# EAGLE design isp_rev_3 (EAGLE 6.3)
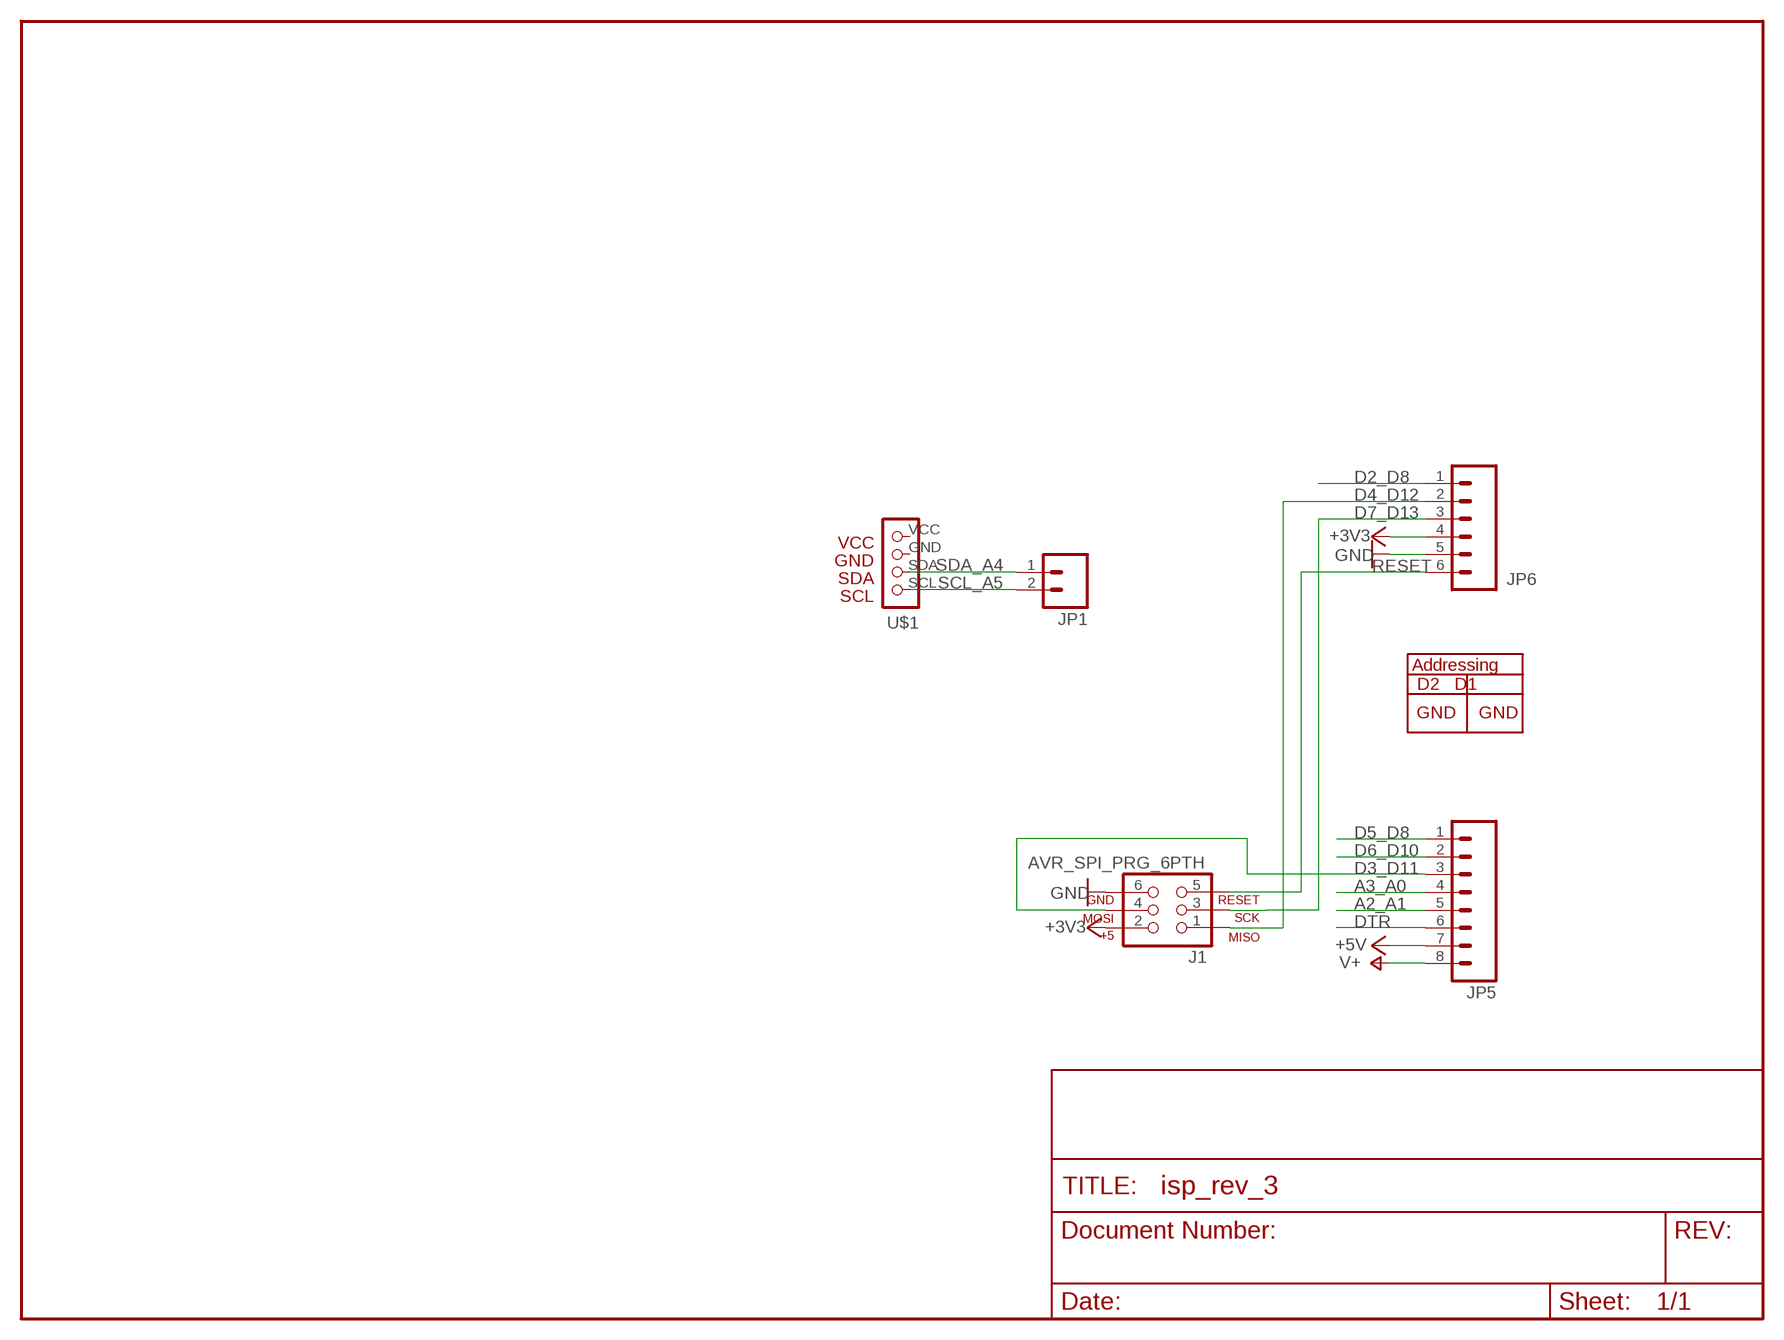
[diagram p0: schematic, sheet 1]

## Parts
J1  AVR_SPI_PRG_6PTH  [2X3]
JP1  M02PTH  [1X02]
JP5  M081X08  [1X08]
JP6  M06SIP  [1X06]
U$1  NUNCHUCKCHUCK  [CONN]

## Nets
+3V3: J1.2 JP6.4
+5V: JP5.7
A2_A1: JP5.5
A3_A0: JP5.4
D2_D8: JP6.1
D3_D11: J1.4 JP5.3
D4_D12: J1.1 JP6.2
D5_D8: JP5.1
D6_D10: JP5.2
D7_D13: J1.3 JP6.3
DTR: JP5.6
GND: J1.6 JP6.5
RESET: J1.5 JP6.6
SCL_A5: JP1.2 U$1.SCL
SDA_A4: JP1.1 U$1.SDA
V+: JP5.8
Unconnected: U$1.GND U$1.VCC

## Library data of the parts
J1 = SparkFun:AVR_SPI_PRG_6: AVR ISP 6 Pin This is the reduced ISP connector for AVR programming. Common on Arduino. This footprint will take up less PCB space and can be used with a 10-pin to 6-pin adapter such as SKU: BOB-08508
JP1 = SparkFun_mod:M02: Header 2 Standard 2-pin 0.1" header. Use with straight break away headers (SKU : PRT-00116), right angle break away headers (PRT-00553), swiss pins (PRT-00743), machine pins (PRT-00117), and female headers (PRT-00115). Molex polarized connector foot print use with SKU : PRT-08233 with associated crimp pins and housings.
JP5 = SparkFun_mod:M08: Header 8 Standard 8-pin 0.1" header. Use with straight break away headers (SKU : PRT-00116), right angle break away headers (PRT-00553), swiss pins (PRT-00743), machine pins (PRT-00117), and female headers (PRT-00115).
JP6 = SparkFun:M06: Header 6 Standard 6-pin 0.1" header. Use with straight break away headers (SKU : PRT-00116), right angle break away headers (PRT-00553), swiss pins (PRT-00743), machine pins (PRT-00117), and female headers (PRT-00115). Molex polarized connector foot print use with SKU : PRT-08094 with associated crimp pins and housings. NOTES ON THE VARIANTS LOCK and LOCK_LONGPADS... This footprint was designed to help hold the alignment of a through-hole component (i.e. 6-pin header) while soldering it into place. You may notice that each hole has been shifted either up or down by 0.005 of an inch from it's more standard position (which is a perfectly straight line). This slight alteration caused the pins (the squares in the middle) to touch the edges of the holes. Because they are alternating, it causes a "brace" to hold the component in place. 0.005 has proven to be the perfect amount of "off-center" position when using our standard breakaway headers. Although looks a little odd when you look at the bare footprint, once you have a header in there, the alteration is very hard to notice. Also, if you push a header all the way into place, it is covered up entirely on the bottom side. This idea of altering the position of holes to aid alignment will be further integrated into the Sparkfun Library for other footprints. It can help hold any component with 3 or more connection pins.
U$1 = _my-parts:NUNCHUCK

## Net classes
0 default: width 0.203 mm
1 vcc: width 0.254 mm

## Board
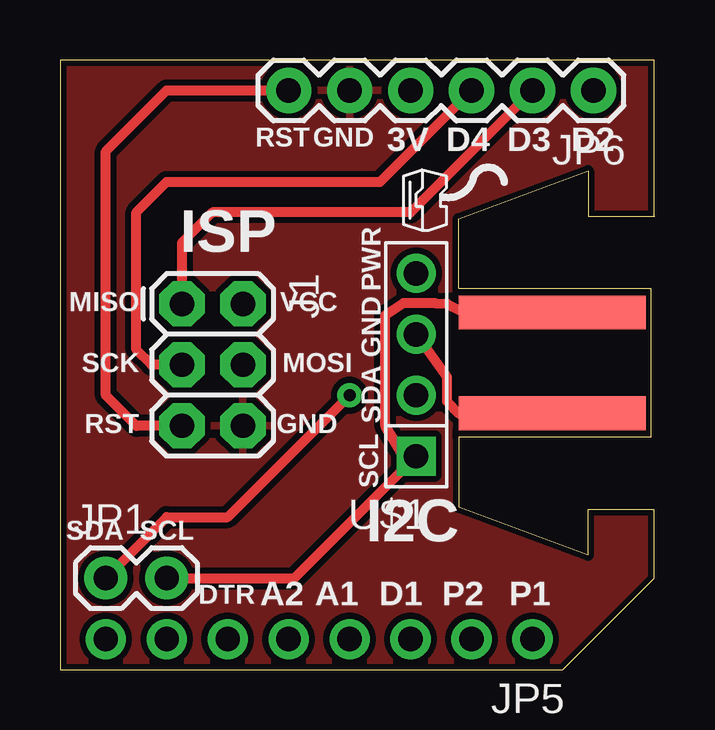
[diagram p1: board, top side]
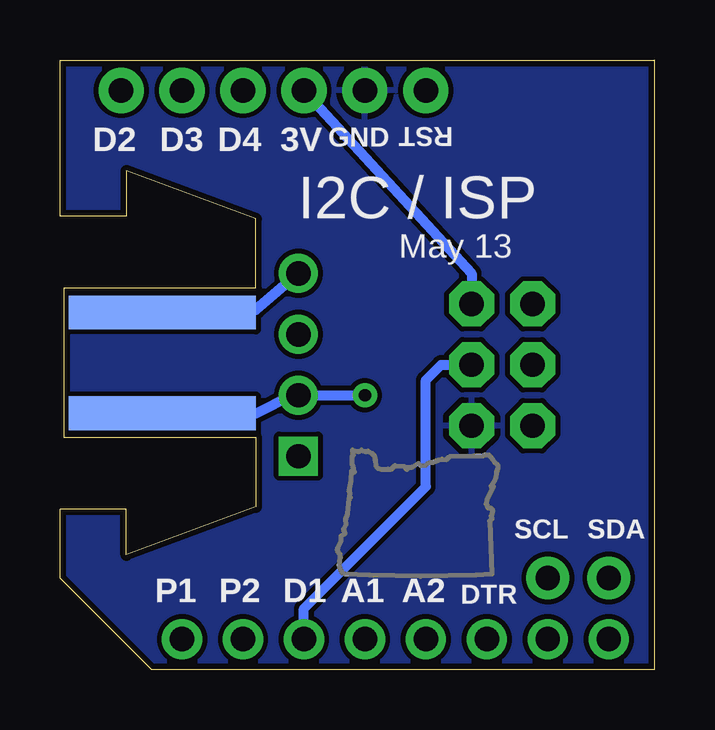
[diagram p2: board, bottom side, seen from below]

Size 24.77 x 25.4 mm. Coordinates in mm from the lower left corner, seen from the top.
Outline: 0,0 0,3.81 0,25.4 0,25.4 3.81,25.4 24.77,25.4 24.77,20.32
Outline: 0,0 20.96,0 24.77,3.81
Outline: 24.77,3.81 24.77,3.81
Outline: 24.77,3.81 24.77,5.08
Copper layers (1*16): Top 0.035mm / dielectric 1.5mm / Bottom 0.035mm
Design rules "SparkFun": minimum track width 8mil, minimum drill 20mil, track to track 8mil, track to pad 8mil, pad to pad 8mil, via to via 8mil, smd to smd 8mil, copper to edge 10mil, drill to drill 8mil, minimum pad ring 12mil, minimum via ring 10mil, stop-mask expansion 4mil, vias tented up to drill 25mil, thermal gap 10mil

### Footprints (pad centres in the part's own frame; a part is rotated, then mirrored left to right if it is on the bottom)
2X3 = drill 1.016 pad 1.88 octagon: 1 0,0; 2 0,2.54; 3 2.54,0; 4 2.54,2.54; 5 5.08,0; 6 5.08,2.54
1X02 = drill 1.016 pad 1.778: 1 0,0; 2 2.54,0
1X08 = drill 1.016 pad 1.676: 1 0,0; 2 2.54,0; 3 5.08,0; 4 7.62,0; 5 10.16,0; 6 12.7,0; 7 15.24,0; 8 17.78,0
1X06 = drill 1.016 pad 1.88: 1 0,0; 2 2.54,0; 3 5.08,0; 4 7.62,0; 5 10.16,0; 6 12.7,0
CONN = drill 1.016: GND -0.23,3.81; SDA -0.23,6.35; VCC -0.23,1.27 | smd 7.8 x 1.4 bottom: P$1_SDA -5.9,7.1; P$4_VCC -5.9,2.9 | smd 7.8 x 1.4: P$2_SCL -5.9,2.9; P$3_GND -5.9,7.1 | drill 1.016 square: SCL -0.23,8.89

### Placement (x,y rotation side)
J1  5.08,15.24 270 top
JP1  1.91,3.81 0 top
JP5  19.69,1.27 180 top
JP6  22.23,24.13 180 top
U$1  14.61,17.78 180 top
U$2  [OREGON_18_52]  12.58,9.15 0 top

### Tracks (layer width: path | path; a pad name or v marks a point on that pad's centre or on a via)
+3V3
  Bottom 0.406: JP6.4 7.62,16.51 J1.2
D3_D11
  Bottom 0.406: JP5.3 14.61,2.54 9.53,7.62 9.53,12.07 8.89,12.7 J1.4
D4_D12
  Top 0.406: JP6.2 14.61,19.05 6.35,19.05 5.08,17.78 J1.1
D7_D13
  Top 0.406: J1.3 3.81,12.7 3.18,13.34 3.18,19.05 4.45,20.32 13.34,20.32 JP6.3
GND
  pour Bottom: 26.04,-1.27 -1.9,-1.27 -1.9,26.67 26.04,26.67
  pour Top (isolate 0.254): 25.4,-0.63 -1.9,-0.63 -1.9,25.4 -1.27,26.04 25.4,26.04
RESET
  Top 0.406: J1.5 3.18,10.16 1.91,11.43 1.91,21.59 4.45,24.13 JP6.6
SCL_A5
  Top 0.406: JP1.2 9.76,3.81 U$1.SCL
SDA_A4  (via drill 0.51)
  Top 0.406: JP1.1 4.45,6.35 6.99,6.35 v12.07,11.43
  Bottom 0.406: U$1.SDA v12.07,11.43

### Text on the board
tPlace: MakersBox.blogspot.com | RST | GND | 3V | D4 | D3 | D2 | ISP | MISO | VCC | SCK | MOSI | RST | GND | Atmega328 | I2C | SDA | SCL | DTR | A2 | A1 | D1 | P2 | P1
bPlace: RST | GND | 3V | D4 | D3 | D2 | I2C / ISP | May 13 | i2c | SDA | SCL | DTR | A2 | A1 | D1 | P2 | P1 | MakersBox.blogspot.com